# EasyEDA schematic SCH_DekiSuki_2026-05-25.json
TITLE: Sheet_1; REV: 1.0; Date: 2026-05-20; Sheet: 1/1; Drawn By: lastsurvivor857; Company: Your Company
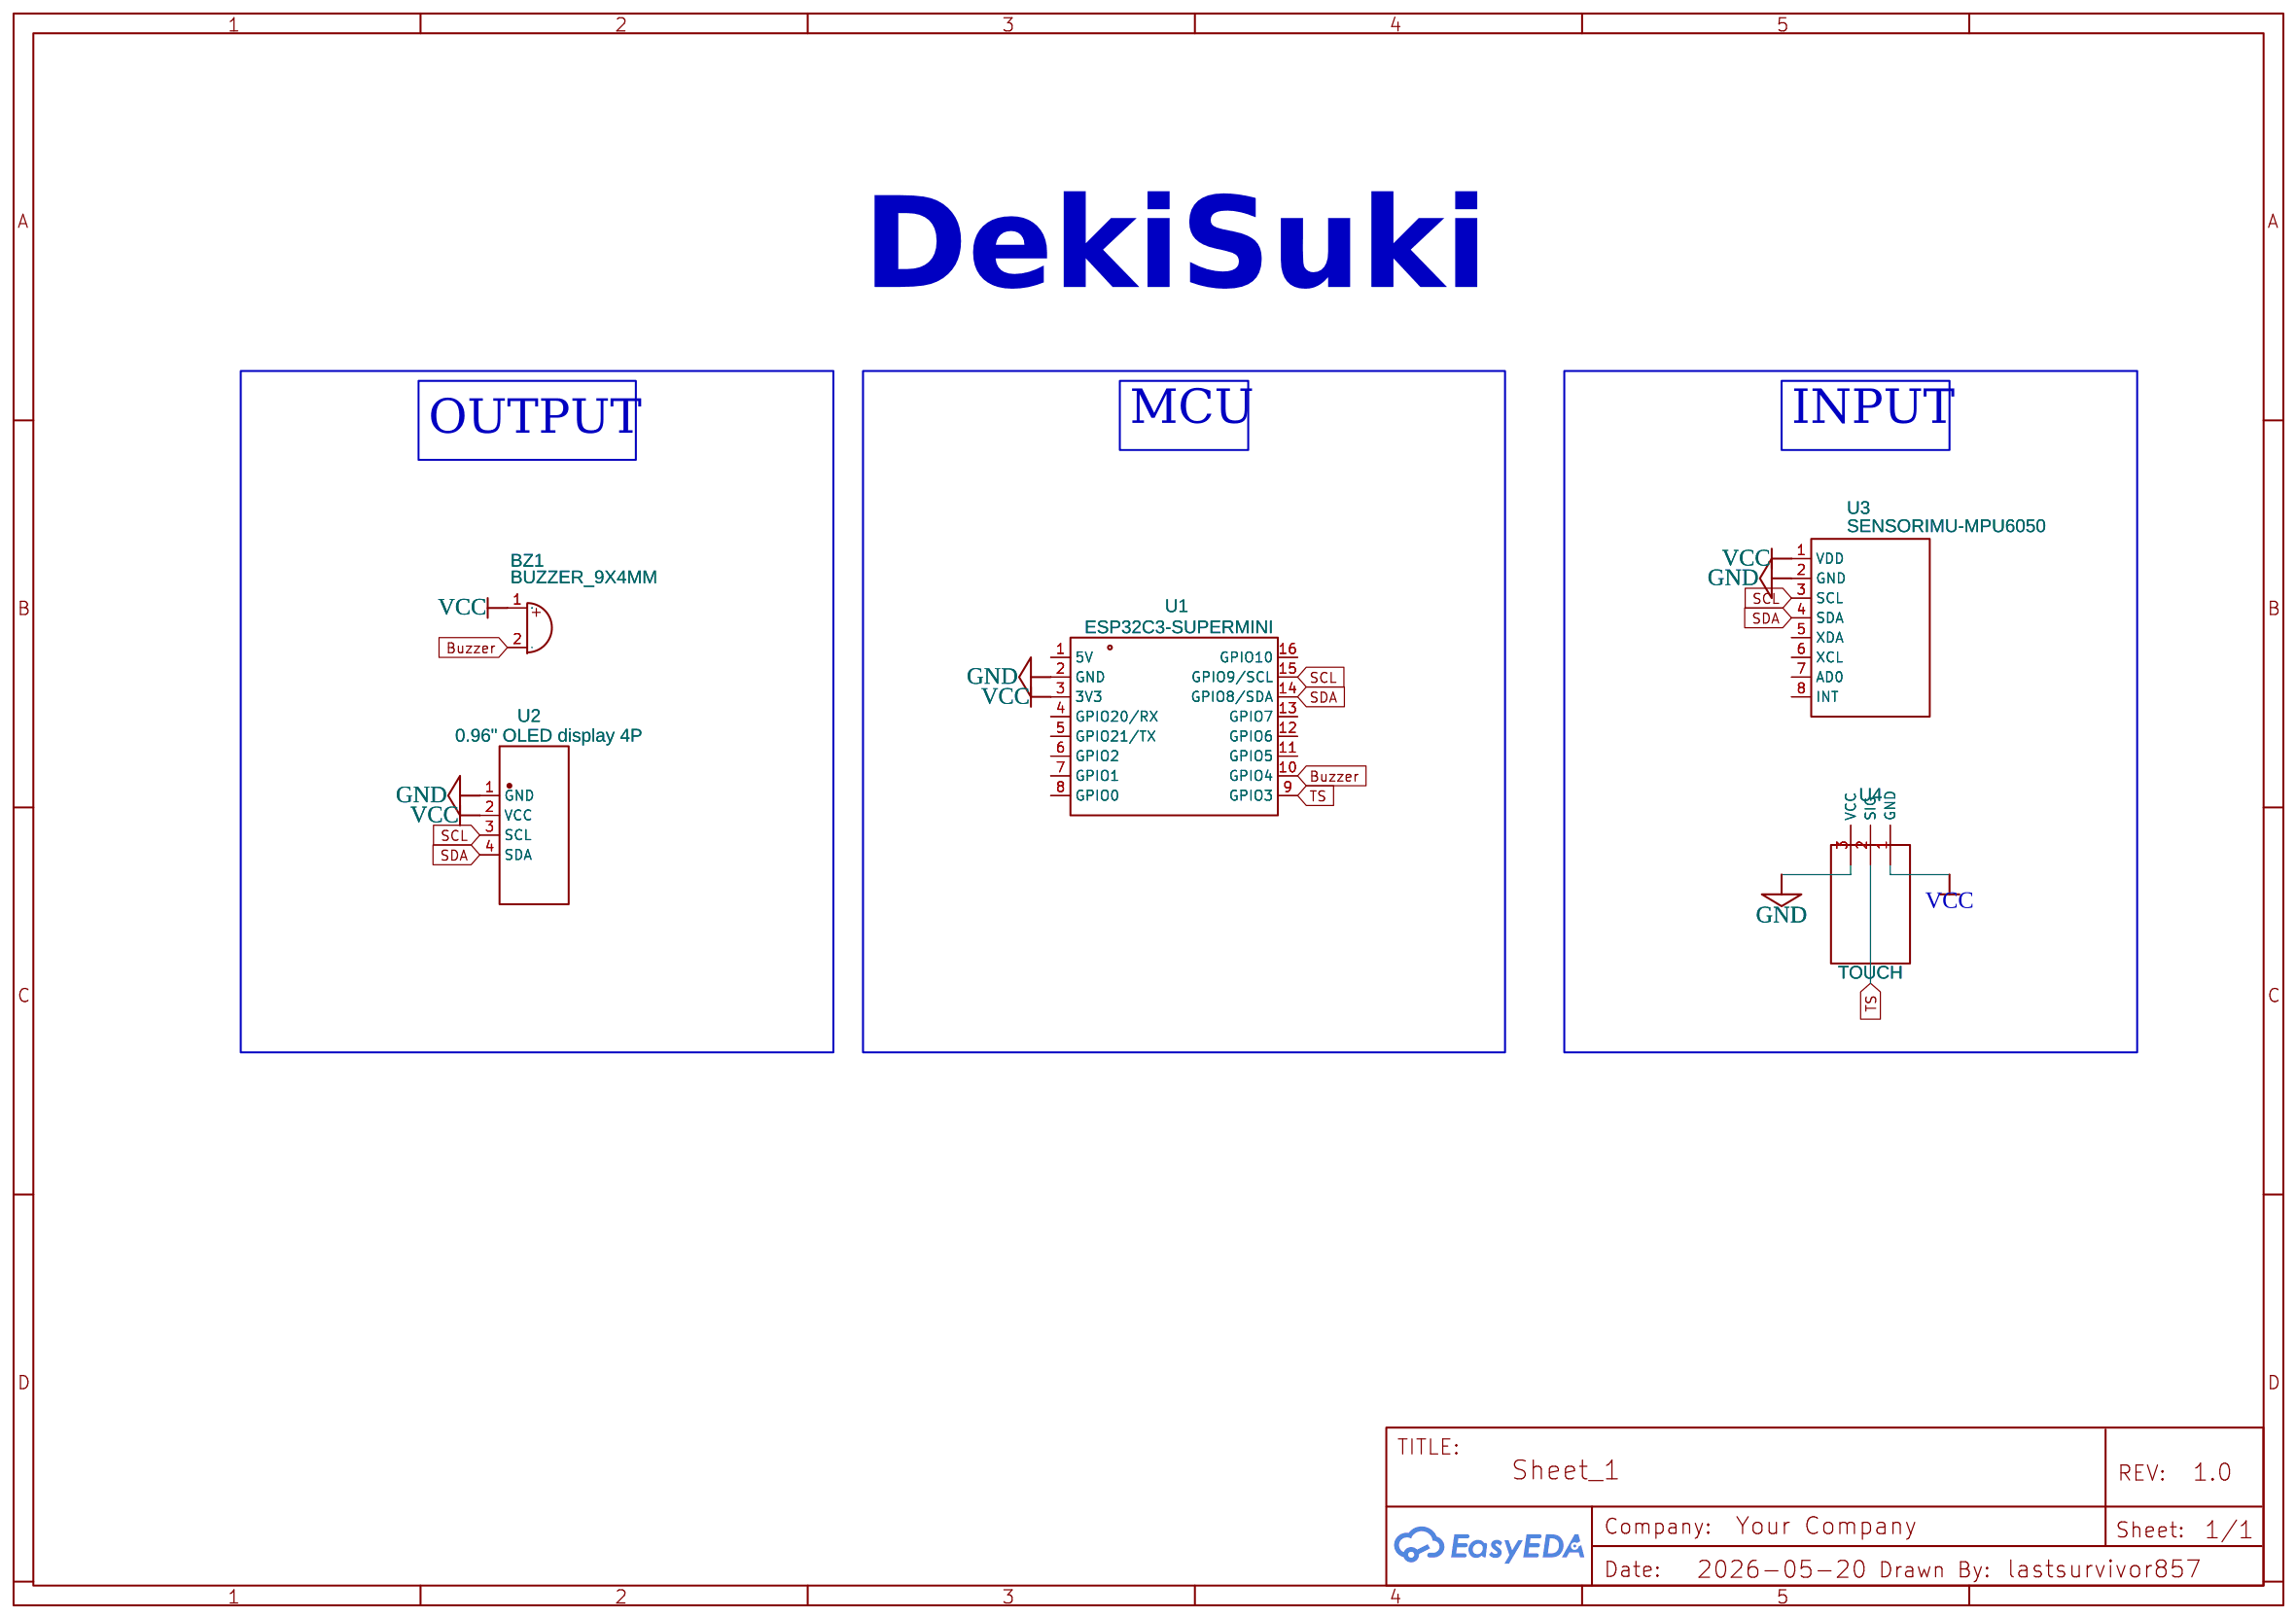
[diagram p0: schematic sheet]

## Parts
BZ1  BUZZER_9X4MM  [BUZZER_BEEPER:BUZZER_9X4MM]
U1  ESP32C3-SUPERMINI  [ESP32-C3_SUPERMINI:MODULE_ESP32-C3_SUPERMINI]
U2  0.96" OLED display 4P  [OLED-TH_OLED0.96-SPI]
U3  SENSORIMU-MPU6050  [MPU6050-FOOTPRINT]
U4  TOUCH  [TTP223B CAPACITIVE DIGITAL TOUCH SENSOR TOUCH BUTTON MODULE]

## Library data of the parts
BZ1 = Device_Buzzer: Add into BOM: yes; Convert to PCB: yes; Origin Footprint: Buzzer_Beeper:Buzzer_12x9.5RM7.6; Contributor: huydoquang5204
U1 = ESP32C3-SUPERMINI COPY: Device: ESP32C3-SuperMini; LCSC Part Name: ESP32C3-SuperMini; Supplier Part: C9900147397; Manufacturer Part: ESP32C3-SuperMini; Supplier Footprint: SMD-16P; JLCPCB Part Class: Extended Part; Supplier: LCSC; Add into BOM: yes; Convert to PCB: yes; Contributor: muhammadbilalma
U2 = 0.96" OLED display 4P: Supplier Part: C9900027058; Manufacturer: 郑州中景园电子技术有限公司; Manufacturer Part: ZJY096S0700BG01蓝色; link: https://img.jlc.com/pdf/applyPasteComponent/2022-08-15/203417A/337c2d88c1b34c958220578f8c1ccd46/ZJY096S0700WG01.pdf; Contributor: exitte
U3 = SENSORIMU-MPU6050: Contributor: LCSC; JLCPCB Part Class: Extended Part
U4 = CAPACITIVE TOUCH GND-SIG-VCC COPY: Contributor: sabintas

## Nets
GND: U1.2(GND) U2.1(GND) U3.2(GND) U4.3(VCC)
VCC: BZ1.1(+) U1.3(3V3) U2.2(VCC) U3.1(VDD) U4.1(GND)
Buzzer: BZ1.2(-) U1.10(GPIO4)
SCL: U1.15(GPIO9/SCL) U2.3(SCL) U3.3(SCL)
SDA: U1.14(GPIO8/SDA) U2.4(SDA) U3.4(SDA)
TS: U1.9(GPIO3) U4.2(SIG)

Not connected (* = marked no-connect by the designer): U1 1(5V) 4(GPIO20/RX) 5(GPIO21/TX) 6(GPIO2) 7(GPIO1) 8(GPIO0) 11(GPIO5) 12(GPIO6) 13(GPIO7) 16(GPIO10); U3 5(XDA) 6(XCL) 7(AD0) 8(INT)

## Notes on the sheet
- DekiSuki
- MCU
- INPUT
- OUTPUT
